# EAGLE design Unvrsl_INA125P_V1 (EAGLE 9.5.2)
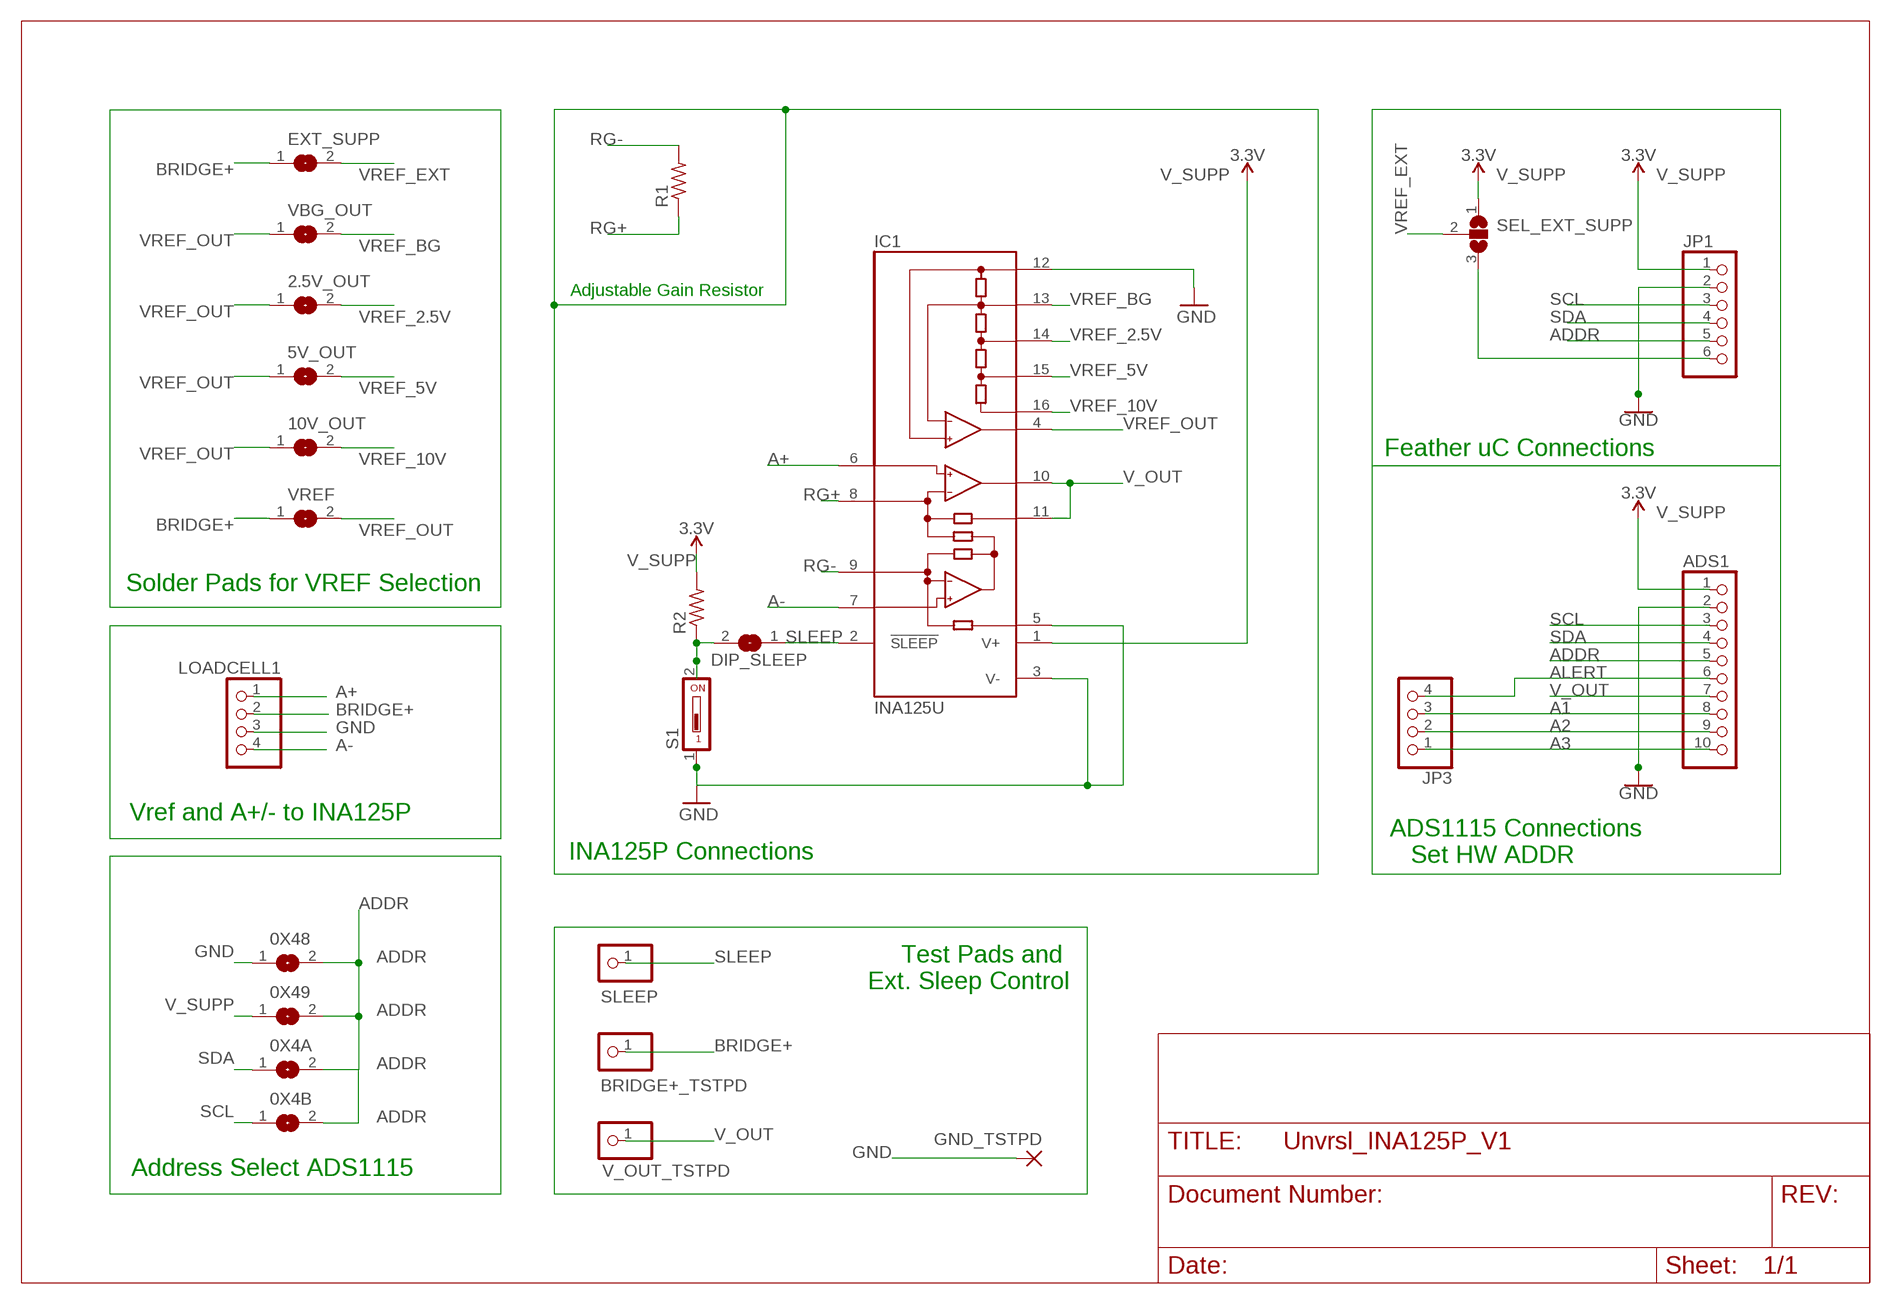
[diagram p0: schematic, sheet 1]

## Parts
0X4A  SJ  [SJ]
0X4B  SJ  [SJ]
0X48  SJ  [SJ]
0X49  SJ  [SJ]
2.5V_OUT  SJ  [SJ]
5V_OUT  SJ  [SJ]
10V_OUT  SJ  [SJ]
ADS1  PINHD-1X10  [1X10]
BRIDGE+_TSTPD  PINHD-1X1  [1X01]
DIP_SLEEP  SJ  [SJ]
EXT_SUPP  SJ  [SJ]
GND_TSTPD  WIREPADSMD2,54-5,08  [SMD2,54-5,08]
IC1  INA125U  [SO16-1]
JP1  PINHD-1X6  [1X06]
JP3  PINHD-1X4  [1X04]
LOADCELL1  PINHD-1X4  [1X04]
R1  R-US_R0603  [R0603]
R2  R-US_R1206  [R1206]
S1  DS01  [DS-01]
SEL_EXT_SUPP  SJ2WW  [SJ_2W]
SLEEP  PINHD-1X1  [1X01]
V_OUT_TSTPD  PINHD-1X1  [1X01]
VBG_OUT  SJ  [SJ]
VREF  SJ  [SJ]

## Nets
A1: ADS1.8 JP3.3
A2: ADS1.9 JP3.2
A3: ADS1.10 JP3.1
A+: IC1.6(+IN) LOADCELL1.1
A-: IC1.7(-IN) LOADCELL1.4
ADDR: 0X4A.2 0X4B.2 0X48.2 0X49.2 ADS1.5 JP1.5
ALERT: ADS1.6 JP3.4
BRIDGE+: BRIDGE+_TSTPD.1 EXT_SUPP.1 LOADCELL1.2 VREF.1
GND: 0X48.1 ADS1.2 GND_TSTPD.1(P) IC1.3(V-) IC1.5(REF) IC1.12(REFCOM) JP1.2 LOADCELL1.3 S1.1
N$16: JP1.6 SEL_EXT_SUPP.3
N$22: DIP_SLEEP.2 R2.1 S1.2
RG+: IC1.8(RG) R1.1
RG-: IC1.9(RG) R1.2
SCL: 0X4B.1 ADS1.3 JP1.3
SDA: 0X4A.1 ADS1.4 JP1.4
SLEEP: DIP_SLEEP.1 IC1.2(!SLEEP) SLEEP.1
V_OUT: ADS1.7 IC1.10(OUT) IC1.11(SENSE) V_OUT_TSTPD.1
V_SUPP: 0X49.1 ADS1.1 IC1.1(V+) JP1.1 R2.2 SEL_EXT_SUPP.1 ; supply symbol labelled 3.3V
VREF_2.5V: 2.5V_OUT.2 IC1.14(REF2.5)
VREF_5V: 5V_OUT.2 IC1.15(REF5)
VREF_10V: 10V_OUT.2 IC1.16(REF10)
VREF_BG: IC1.13(REFBG) VBG_OUT.2
VREF_EXT: EXT_SUPP.2 SEL_EXT_SUPP.2
VREF_OUT: 2.5V_OUT.1 5V_OUT.1 10V_OUT.1 IC1.4(REFOUT) VBG_OUT.1 VREF.2

## Notes on the sheet
- Adjustable Gain Resistor
- Feather uC Connections
- Solder Pads for VREF Selection
- Vref and A+/- to INA125P
- INA125P Connections
- ADS1115 Connections
     Set HW ADDR
- Test Pads and 
  Ext. Sleep Control
- Address Select ADS1115

## Library data of the parts
0X4A 0X4B 0X48 0X49 2.5V_OUT 5V_OUT 10V_OUT DIP_SLEEP EXT_SUPP VBG_OUT VREF = jumper:SJ: SMD solder JUMPER
ADS1 = pinhead:PINHD-1X10: PIN HEADER
BRIDGE+_TSTPD SLEEP V_OUT_TSTPD = pinhead:PINHD-1X1: PIN HEADER
GND_TSTPD = wirepad:WIREPAD: Wire PAD connect wire on PCB
IC1 = burr-brown:INA125: Instrumentation Amplifier with Precision Voltage Reference; MF: TEXAS INSTRUMENT CONNECTORS; MPN: INA125U; OC_FARNELL: 1304375; OC_NEWARK: 80K5901
JP1 = pinhead:PINHD-1X6: PIN HEADER
JP3 LOADCELL1 = pinhead:PINHD-1X4: PIN HEADER
R1 R2 = rcl:R-US_: RESISTOR, American symbol; SPICEPREFIX: R
S1 = switch-dil:DS01: DIL/CODE SWITCH; OC_FARNELL: unknown; OC_NEWARK: unknown
SEL_EXT_SUPP = jumper:SJ2W: SMD solder JUMPER

## Board
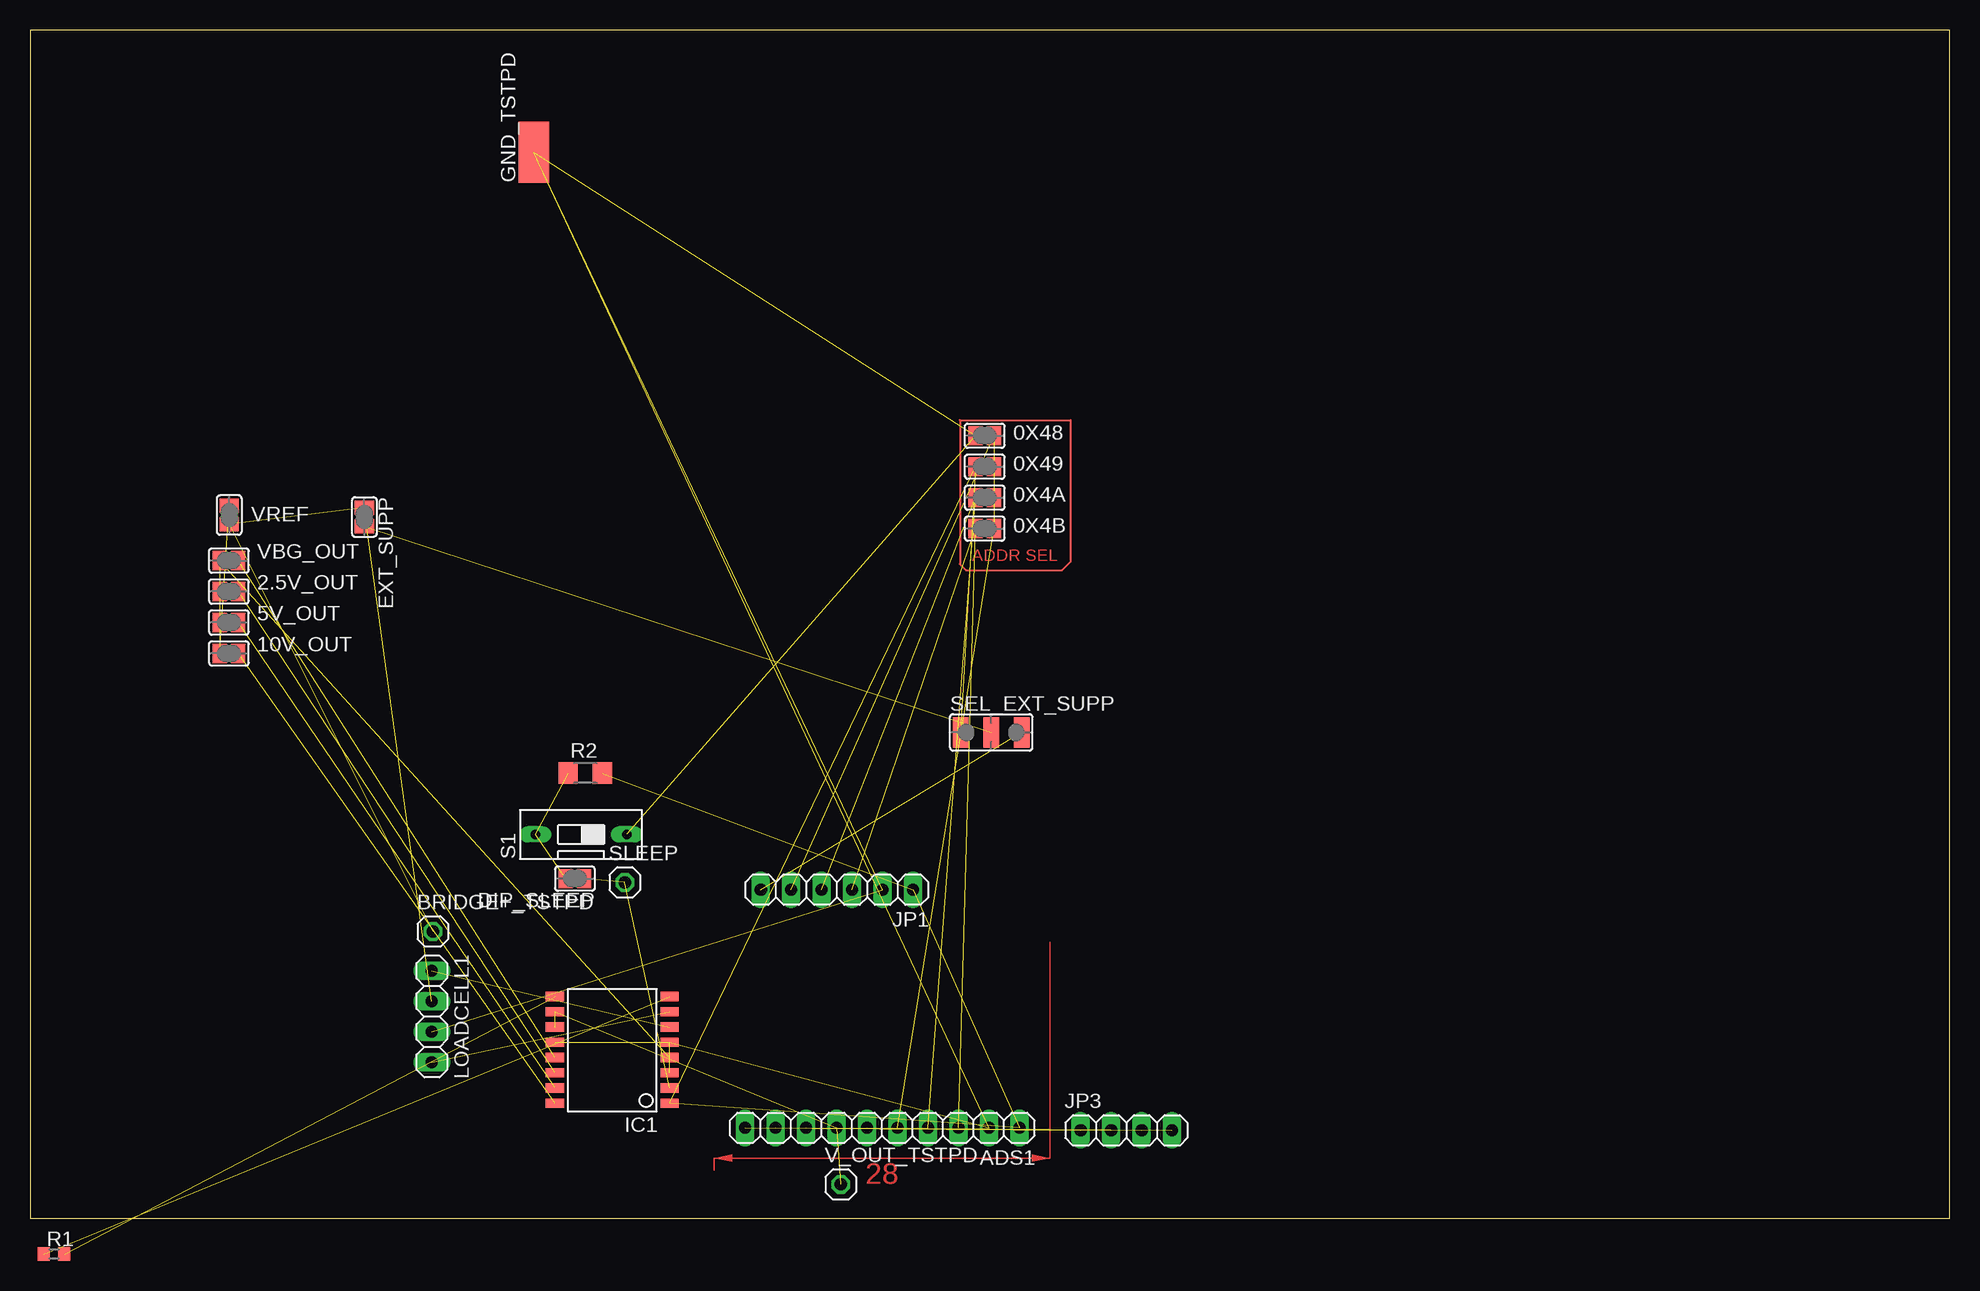
[diagram p1: board, top side]

Size 160 x 99 mm. Coordinates in mm from the lower left corner, seen from the top.
Outline: 0,0 160,0 160,99 0,99 0,0
Copper layers (1*16): Top 0.035mm / dielectric 1.5mm / Bottom 0.035mm
Design rules "default": minimum track width 6mil, minimum drill 0.35mm, track to track 6mil, track to pad 6mil, pad to pad 6mil, via to via 6mil, smd to smd 6mil, copper to edge 40mil, drill to drill 6mil, minimum pad ring 10mil, minimum via ring 8mil, stop-mask expansion 4mil, vias tented up to drill 0mil, thermal gap 10mil

### Footprints (pad centres in the part's own frame; a part is rotated, then mirrored left to right if it is on the bottom)
SJ = smd 1.168 x 1.6: 1 -0.762,0; 2 0.762,0
1X10 = drill 1.016 long: 1 -11.43,0; 2 -8.89,0; 3 -6.35,0; 4 -3.81,0; 5 -1.27,0; 6 1.27,0; 7 3.81,0; 8 6.35,0; 9 8.89,0; 10 11.43,0
1X01 = drill 1.016 octagon: 1 0,0
SMD2,54-5,08 = smd 2.54 x 5.08: 1 0,0
SO16-1 = smd 0.762 x 1.524: 1 -4.445,-4.775; 2 -3.175,-4.775; 3 -1.905,-4.775; 4 -0.635,-4.775; 5 0.635,-4.775; 6 1.905,-4.775; 7 3.175,-4.775; 8 4.445,-4.775; 9 4.445,4.775; 10 3.175,4.775; 11 1.905,4.775; 12 0.635,4.775; 13 -0.635,4.775; 14 -1.905,4.775; 15 -3.175,4.775; 16 -4.445,4.775
1X06 = drill 1.016 long: 1 -6.35,0; 2 -3.81,0; 3 -1.27,0; 4 1.27,0; 5 3.81,0; 6 6.35,0
1X04 = drill 1.016 long: 1 -3.81,0; 2 -1.27,0; 3 1.27,0; 4 3.81,0
R0603 = smd 1 x 1.1: 1 -0.85,0; 2 0.85,0
R1206 = smd 1.6 x 1.803: 1 -1.422,0; 2 1.422,0
DS-01 = drill 0.813 long: 1 0,-3.81; 2 0,3.81
SJ_2W = smd 1.27 x 2.54: 1 -2.54,0; 2 0,0; 3 2.54,0

### Placement (x,y rotation side)
0X4A  79.58,60.03 0 top
0X4B  79.58,57.45 0 top
0X48  79.58,65.19 0 top
0X49  79.58,62.61 0 top
2.5V_OUT  16.58,52.21 0 top
5V_OUT  16.58,49.63 0 top
10V_OUT  16.58,47.05 0 top
ADS1  71.04,7.51 180 top
BRIDGE+_TSTPD  33.58,23.88 0 top
DIP_SLEEP  45.42,28.28 180 top
EXT_SUPP  27.87,58.42 270 top
GND_TSTPD  41.98,88.81 0 top
IC1  48.53,14.01 90 top
JP1  67.26,27.36 180 top
JP3  91.39,7.31 0 top
LOADCELL1  33.49,16.79 270 top
R1  2,-3 0 top
R2  46.28,37.07 0 top
S1  45.93,31.96 90 top
SEL_EXT_SUPP  80.12,40.47 0 top
SLEEP  49.58,27.96 0 top
V_OUT_TSTPD  67.58,2.8 0 top
VBG_OUT  16.58,54.79 0 top
VREF  16.61,58.58 90 top

### Tracks (layer width: path | path; a pad name or v marks a point on that pad's centre or on a via)
A1  (1 unrouted)
A2  (1 unrouted)
A3  (1 unrouted)
A+  (1 unrouted)
A-  (1 unrouted)
ADDR  (5 unrouted)
ALERT  (1 unrouted)
BRIDGE+  (3 unrouted)
GND  (8 unrouted)
N$16  (1 unrouted)
N$22  (2 unrouted)
RG+  (1 unrouted)
RG-  (1 unrouted)
  Top 0.152: 77.5,66.5 77.5,54.5 78,54 86,54 86.75,54.75 86.75,66.5 77.5,66.5
SCL  (2 unrouted)
SDA  (2 unrouted)
SLEEP  (2 unrouted)
V_OUT  (3 unrouted)
V_SUPP  (5 unrouted)
VREF_2.5V  (1 unrouted)
VREF_5V  (1 unrouted)
VREF_10V  (1 unrouted)
VREF_BG  (1 unrouted)
VREF_EXT  (1 unrouted)
VREF_OUT  (5 unrouted)
(copper drawn outside any net)
  shapes: Top area x2

### Text on the board
Top: ADDR SEL